# Altium project RCB_WiWi_STM32WL3.PrjPcb (part 2 of 2)

## Sheet 06-STM32WL3-RX.SchDoc
size B; SheetNumber: 6; SheetTotal: 8
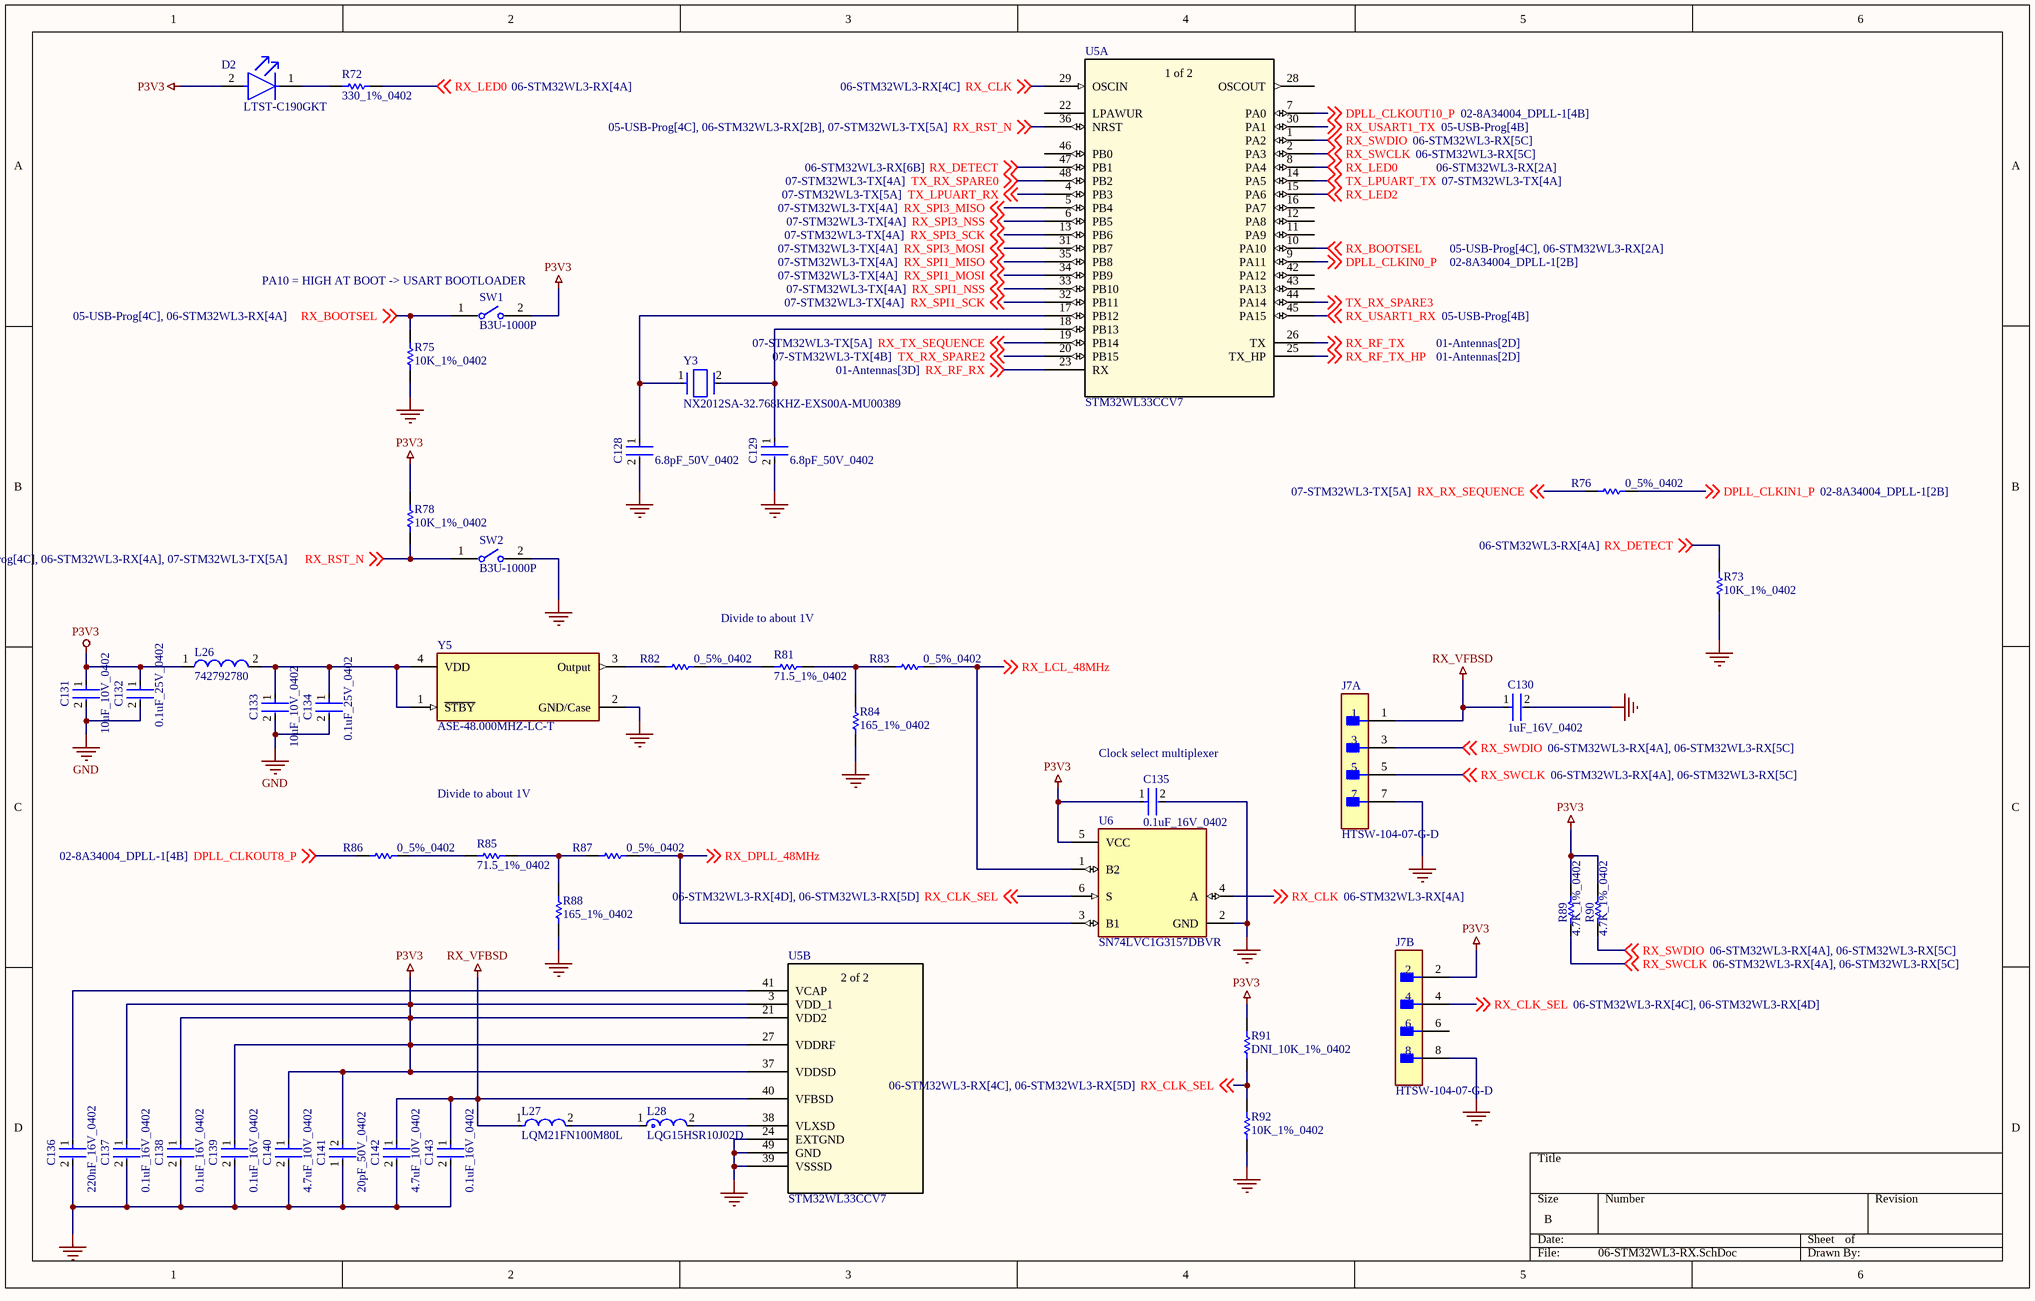
[diagram p3: 06-STM32WL3-RX.SchDoc]

### Parts
C128  6.8pF_50V_0402  [FP-GJM155-0_05-IPC_A]
C129  6.8pF_50V_0402  [FP-GJM155-0_05-IPC_A]
C130  1uF_16V_0402  [FP-0402-L_1_0_0_05-W_0_5-IPC_A]
C131  10uF_10V_0402  [FP-CL05A106MP5NUNC-MFG]
C132  0.1uF_25V_0402  [FP-0402-L_1_0_1-W_0_5_0_1-IPC_C]
C133  10uF_10V_0402  [FP-CL05A106MP5NUNC-MFG]
C134  0.1uF_25V_0402  [FP-0402-L_1_0_1-W_0_5_0_1-IPC_C]
C135  0.1uF_16V_0402  [FP-C0402-BB-MFG]
C136  220nF_16V_0402  [FP-GRM155-0_05-IPC_C]
C137  0.1uF_16V_0402  [FP-C0402-BB-MFG]
C138  0.1uF_16V_0402  [FP-C0402-BB-MFG]
C139  0.1uF_16V_0402  [FP-C0402-BB-MFG]
C140  4.7uF_10V_0402  [FP-C1005-050-0_15-MFG]
C141  20pF_50V_0402  [FP-CBR04C-MFG]
C142  4.7uF_10V_0402  [FP-C1005-050-0_15-MFG]
C143  0.1uF_16V_0402  [FP-C0402-BB-MFG]
D2  LTST-C190GKT  [FP-LTST-C190GKT-MFG]
J7  HTSW-104-07-G-D  [FP-HTSW-104-07-G-D-MFG]  (parts A,B of 2)
L26  742792780  [SMD-0402]
L27  LQM21FN100M80L  [FP-LQM21DH_70-IPC_C]
L28  LQG15HSR10J02D  [FP-LQG15HH_02-IPC_A]
R72  330_1%_0402  [RESC1005X40X25NL10T10]
R73  10K_1%_0402  [RESC1005X40X25NL10T10]
R75  10K_1%_0402  [RESC1005X40X25NL10T10]
R76  0_5%_0402  [RESC1005X40X25NL05T10]
R78  10K_1%_0402  [RESC1005X40X25NL10T10]
R81  71.5_1%_0402  [RESC1005X40X25NL05T05]
R82  0_5%_0402  [RESC1005X40X25NL05T10]
R83  0_5%_0402  [RESC1005X40X25NL05T10]
R84  165_1%_0402  [RESC1005X40X25NL05T05]
R85  71.5_1%_0402  [RESC1005X40X25NL05T05]
R86  0_5%_0402  [RESC1005X40X25NL05T10]
R87  0_5%_0402  [RESC1005X40X25NL05T10]
R88  165_1%_0402  [RESC1005X40X25NL05T05]
R89  4.7K_1%_0402  [RESC1005X40X25NL10T10]
R90  4.7K_1%_0402  [RESC1005X40X25NL10T10]
R91  DNI_10K_1%_0402  [RESC1005X40X25NL10T10]  (no BOM)
R92  10K_1%_0402  [RESC1005X40X25NL10T10]
SW1  B3U-1000P  [FP-B3U-1000P-MFG]
SW2  B3U-1000P  [FP-B3U-1000P-MFG]
U5  STM32WL33CCV7  [UFQFPN-48_STM]  (parts A,B of 2)
U6  SN74LVC1G3157DBVR  [FP-DBV0006A-IPC_C]
Y3  NX2012SA-32.768KHZ-EXS00A-MU00389  [FP-NX2012SA-MFG]
Y5  ASE-48.000MHZ-LC-T  [FP-ASE-MFG]

### Nets
GND: C128.2 C129.2 C130.2 C131.2 C132.2 C133.2 C134.2 C135.2 C136.2 C137.2 C138.2 C139.2 C140.2 C141.1 C142.2 C143.2 J7.7 J7.8 R73.2 R75.2 R84.1 R88.1 R92.2 SW2.2 U5.24(EXTGND) U5.39(VSSSD) U5.49(GND) U6.2(GND) Y5.2(GND/Case)
P3V3: C131.1 C132.1 C135.1 C137.1 C138.1 C139.1 C140.1 C141.2 D2.2(A) J7.2 L26.1 R78.1 R89.2 R90.2 R91.1 SW1.2 U5.3(VDD_1) U5.21(VDD2) U5.27(VDDRF) U5.37(VDDSD) U6.5(VCC)
RX_VFBSD: C130.1 C142.1 C143.1 J7.1 L27.1 U5.40(VFBSD)
DPLL_CLKIN0_P: U5.9(PA11) ; off-sheet DPLL_CLKIN0_P
DPLL_CLKIN1_P: R76.2 ; off-sheet DPLL_CLKIN1_P
DPLL_CLKOUT8_P: R86.1 ; off-sheet DPLL_CLKOUT8_P
DPLL_CLKOUT10_P: U5.7(PA0) ; off-sheet DPLL_CLKOUT10_P
RX_BOOTSEL: R75.1 SW1.1 U5.10(PA10) ; off-sheet RX_BOOTSEL
RX_CLK: U5.29(OSCIN) U6.4(A) ; off-sheet RX_CLK
RX_CLK_SEL: J7.4 R91.2 R92.1 U6.6(S) ; off-sheet RX_CLK_SEL
RX_DETECT: R73.1 U5.47(PB1) ; off-sheet RX_DETECT
RX_DPLL_48MHz: R87.2 U6.3(B1) ; off-sheet RX_DPLL_48MHz
RX_LCL_48MHz: R83.2 U6.1(B2) ; off-sheet RX_LCL_48MHz
RX_LED0: R72.1 U5.8(PA4) ; off-sheet RX_LED0
RX_LED2: U5.15(PA6) ; off-sheet RX_LED2
RX_RF_RX: U5.23(RX) ; off-sheet RX_RF_RX
RX_RF_TX: U5.26(TX) ; off-sheet RX_RF_TX
RX_RF_TX_HP: U5.25(TX_HP) ; off-sheet RX_RF_TX_HP
RX_RST_N: R78.2 SW2.1 U5.36(NRST) ; off-sheet RX_RST_N
RX_RX_SEQUENCE: R76.1 ; off-sheet RX_RX_SEQUENCE
RX_SPI1_MISO: U5.35(PB8) ; off-sheet RX_SPI1_MISO
RX_SPI1_MOSI: U5.34(PB9) ; off-sheet RX_SPI1_MOSI
RX_SPI1_NSS: U5.33(PB10) ; off-sheet RX_SPI1_NSS
RX_SPI1_SCK: U5.32(PB11) ; off-sheet RX_SPI1_SCK
RX_SPI3_MISO: U5.5(PB4) ; off-sheet RX_SPI3_MISO
RX_SPI3_MOSI: U5.31(PB7) ; off-sheet RX_SPI3_MOSI
RX_SPI3_NSS: U5.6(PB5) ; off-sheet RX_SPI3_NSS
RX_SPI3_SCK: U5.13(PB6) ; off-sheet RX_SPI3_SCK
RX_SWCLK: J7.5 R89.1 U5.2(PA3) ; off-sheet RX_SWCLK
RX_SWDIO: J7.3 R90.1 U5.1(PA2) ; off-sheet RX_SWDIO
RX_TX_SEQUENCE: U5.19(PB14) ; off-sheet RX_TX_SEQUENCE
RX_USART1_RX: U5.45(PA15) ; off-sheet RX_USART1_RX
RX_USART1_TX: U5.30(PA1) ; off-sheet RX_USART1_TX
TX_LPUART_RX: U5.4(PB3) ; off-sheet TX_LPUART_RX
TX_LPUART_TX: U5.14(PA5) ; off-sheet TX_LPUART_TX
TX_RX_SPARE0: U5.48(PB2) ; off-sheet TX_RX_SPARE0
TX_RX_SPARE2: U5.20(PB15) ; off-sheet TX_RX_SPARE2
TX_RX_SPARE3: U5.44(PA14) ; off-sheet TX_RX_SPARE3
NetC128_1: C128.1 U5.17(PB12) Y3.1
NetC129_1: C129.1 U5.18(PB13) Y3.2
NetC133_1: C133.1 C134.1 L26.2 Y5.1(~{STBY}) Y5.4(VDD)
NetC136_1: C136.1 U5.41(VCAP)
NetD2_1: D2.1(C) R72.2
NetL27_2: L27.2 L28.1
NetL28_2: L28.2 U5.38(VLXSD)
NetR81_1: R81.1 R82.2
NetR81_2: R81.2 R83.1 R84.2
NetR82_1: R82.1 Y5.3(Output)
NetR85_1: R85.1 R86.2
NetR85_2: R85.2 R87.1 R88.2

Not connected (* = marked no-connect by the designer): J7 6; U5 11(PA9) 12(PA8) 16(PA7) 22(LPAWUR) 28(OSCOUT) 42(PA12) 43(PA13) 46(PB0)

### Notes on the sheet
- (near SW1) PA10 = HIGH AT BOOT -> USART BOOTLOADER
- Divide to about 1V
- (near C135) Clock select multiplexer
- (in symbol STM32WL33CCV7, part A) 1 of 2
- (in symbol STM32WL33CCV7, part B) 2 of 2

### Library data of the parts
C128 C129 = CMP-2008-03875-2: Multi-Layer Ceramic Capacitor 6.8pF C0G  ±0.25pF 0402 Paper T/R; Voltage: 50V; Max Operating Temperature: 125°C; Height: 0.5mm; Capacitance: 6.8pF; Thickness: 0.022inch; Length: 1mm; Voltage Rating (DC): 50V; Packaging: Tape and Reel; Voltage Rating: 50V; Case Code (Imperial): 0402; Mount: Surface Mount; Package Quantity: 1; Lead Free: Lead Free; Width: 0.02inch; Radiation Hardening: No; Case Code (Metric): 1005; Depth: 0.5mm; Case/Package: 0402; Dielectric: C0G; Min Operating Temperature: -55°C; Termination: SMD/SMT
C130 = CMP-14477-000104-2: None; Tolerance: 10%; Voltage Rating: 16V; Dielectric: X5R; Capacitance: 1uF; Packaging: Tape and Reel; Depth: 0.5mm; Mount: Surface Mount; Thickness: 0.022inch; Package Quantity: 1; Min Operating Temperature: -55°C; Series: M; Voltage Rating (DC): 16V; Termination: SMD/SMT; Case/Package: 0402; Number of Pins: 2; Case Code (Imperial): 0402; Length: 1mm; Halogen Free: Halogen Free; Case Code (Metric): 1005; Width: 0.02inch; RoHS Compliant: Yes; Radiation Hardening: No; Max Operating Temperature: 85°C; Height: 0.5mm; Construction: Flat
C131 C133 = CMP-13271-000002-1: CAP CER 10UF 10V X5R 0402; Manufacturer Part Number: CL05A106MP5NUNC; Manufacturer: Samsung; Temperature Coefficient: 15%; Tolerance: 20%; Material: Ceramic; Octopart: https://octopart.com/cl05a106mp5nunc-samsung-22457395; Voltage Rating: 10V; RoHS: TRUE; Value: 10uF; Height: 0.7mm; Digikey Description: CAP CER 10UF 10V X5R 0402; Automotive: No; Package: CL05A106MP5NUNC; Device Class L1: Passive Components; Capacitance: 10uF; Temperature Range High: +85°C; ComponentLink2Description: Datasheet; Device Class L2: Capacitors; Temperature Characteristic: X5R; Temperature: -55°C to +85°C; ComponentLink2URL: http://www.samsungsem.com/kr/support/product-search/mlcc/__icsFiles/afieldfile/2019/05/10/19-CL05A106MP5NUNC.pdf; Device Class L3: Ceramic Capacitors; Category: Cap; Temperature Range Low: -55°C; Ipc Land Pattern Name: CAPC10050X50; Lead Free: Yes
C132 C134 = CMP-2008-02519-2: General Purpose Ceramic Capacitor, 0402, 100nF, 10%, X7R, 15%, 25V; Package Quantity: 1; Capacitance: 100nF; Min Operating Temperature: -55°C; Voltage: 25V; Voltage Rating: 25V; Construction: Flat; Max Operating Temperature: 125°C; Radiation Hardening: No; Depth: 0.5mm; Thickness: 0.022inch; Voltage Rating (DC): 25V; Number of Pins: 2; Lead Free: Lead Free; Series: -; REACH SVHC: No SVHC; Length: 1mm; Dielectric: X7R; RoHS Compliant: Yes; Mount: Surface Mount; Packaging: Tape and Reel; Case/Package: 0402; Case Code (Imperial): 0402; Termination: SMD/SMT; Width: 0.02inch; Case Code (Metric): 1005; Tolerance: 10%
C135 C137-C139 C143 = CMP-1034-02068-3: CAP CER 0.1UF 16V 5% X7R 0402; Manufacturer: Kemet; Manufacturer Part Number: C0402C104J4RACTU; Value: 0.10 μF; Temperature Coefficient: 15%; Tolerance: 0.05; Material: Ceramic; ComponentLink2URL: https://content.kemet.com/datasheets/KEM_C1002_X7R_SMD.pdf; Automotive: No; Device Class L2: Capacitors; Temperature: -55°C to +125°C; RoHS: TRUE; Voltage Rating: 16 V; ComponentLink2Description: Datasheet; Device Class L3: Ceramic Capacitors; Temperature Range Low: -55°C; Ipc Land Pattern Name: CAPC10050X50; Device Class L1: Passive Components; Temperature Range High: +125°C; Package: C0402-BB; Capacitance: 0.10 μF; Category: Cap; Mouser Description: CAP CER 0.1UF 16V X7R 0402; Height: 0.55mm; Digikey Description: CAP CER 0.1UF 16V 5% X7R 0402; Octopart: https://octopart.com/c0402c104j4ractu-kemet-12573893; Temperature Characteristic: X7R; Lead Free: Yes
C136 = CMP-1034-02089-3: Chip Multilayer Ceramic Capacitors for General Purpose, 0402, 0.22uF, X7R, 15%, 10%, 16V; Capacitance: 220nF; Depth: 0.5mm; Dielectric: X7R; Min Operating Temperature: -55°C; Package Quantity: 1; Termination: SMD/SMT; Mount: Surface Mount; Radiation Hardening: No; Height: 0.5mm; Case Code (Metric): 1005; Packaging: Tape and Reel; Material: Ceramic; Voltage: 16V; Voltage Rating (DC): 16V; REACH SVHC: No SVHC; Voltage Rating: 16V; Length: 1mm; Tolerance: 10%; Thickness: 0.022inch; Case Code (Imperial): 0402; Max Operating Temperature: 125°C; Width: 0.02inch; Lead Free: Lead Free; Case/Package: 0402
C140 C142 = CMP-2000-05997-2: CAP CER 4.7UF 10V X5R 0402; Dielectric Material: Ceramic; Tolerance: 10%; Series: C; Package Quantity: 10000; Max Operating Temperature: 85°C; Case Code (Imperial): 0402; Lead Free: Lead Free; Voltage Rating (DC): 10V; Packaging: Cut Tape; Voltage Rating: 10V; Min Operating Temperature: -55°C; Dielectric: X5R; Thickness: 0.022inch; Width: 0.02inch; Case/Package: 0402; Case Code (Metric): 1005; Capacitance: 4.7uF; Length: 0.039inch; RoHS Compliant: Yes; REACH SVHC: No SVHC; Mount: Surface Mount
C141 = CMP-2008-00009-2: CAP CER 20PF 50V C0G/NP0 0402; Manufacturer: KEMET; Manufacturer Part Number: CBR04C200J5GAC; Temperature Coefficient: 30ppm/°C; Material: Ceramic; Tolerance: 0.05; Temperature Characteristic: C0G; Automotive: No; Digikey Description: CAP CER 20PF 50V C0G/NP0 0402; Octopart: https://octopart.com/cbr04c200j5gac-kemet-20446742; Lead Free: Yes; Temperature: -55°C to +125°C; ComponentLink2Description: Datasheet; Height: 0.55mm; RoHS: TRUE; Voltage Rating: 50 V; Category: Cap; Value: 20 pF; Mouser Description: Cap Ceramic 20pF 50V C0G 5% SMD 0402 125°C Paper T/R; Package: CBR04C; Device Class L3: Ceramic Capacitors; Temperature Range High: +125°C; Capacitance: 20 pF; ComponentLink2URL: https://content.kemet.com/datasheets/KEM_C1030_CBR_SMD.pdf; Device Class L2: Capacitors; Temperature Range Low: -55°C; Device Class L1: Passive Components; Ipc Land Pattern Name: CAPC10050X50
D2 = CMP-22017-000005-2: LED GREEN CLEAR CHIP SMD; Dominant Wavelength: 569nm; Reverse Voltage: 5V; Lens Color: Colorless; Viewing Angle: 130°; Voltage: 2V; Forward Current: 30mA; Power Dissipation: 100mW; Luminous Intensity: 6mcd; Number of LEDs: 1; Forward Voltage: 2.1V; Wavelength: 565nm; Test Current: 10mA; Min Operating Temperature: -55°C; Lens Style: Clear; Mount: Surface Mount; Width: 0.8mm; Packaging: Tape and Reel; Lens Transparency: Clear; Case Code (Metric): 1608; Depth: 0.8mm; Case Code (Imperial): 0603; Case/Package: 0603; Number of Pins: 2; Max Operating Temperature: 85°C; Lead Free: Lead Free; Number of Elements: 1; Length: 1.6mm; Height: 0.8mm; Package Quantity: 1; Power Rating: 100mW; Radiation Hardening: No; Illumination Color: Green; Color: Green
J7 = CMP-02766-000066-1: CONN HEADER VERT 8POS 2.54MM; Manufacturer: Samtec; Conn Orientation: Straight; Voltage Rating: 550V; Current Rating: 6.3A; Number Of Contacts: 8; Conn Gender: Male; Lead Free: Yes; ComponentLink2URL: http://suddendocs.samtec.com/prints/htsw-xxx-xx-xxx-x-xx-xx-xx-mkt.pdf; Category: Conn; Octopart: https://octopart.com/htsw-104-07-g-d-samtec-10613822; RoHS: TRUE; Device Class L2: Headers and Wire Housings; Device Class L3: unset; ComponentLink2Description: Datasheet; Number Of Rows: 2; Digikey Description: CONN HEADER VERT 8POS 2.54MM; Temperature Range Low: -55°C; Temperature: -55°C to +125°C; Automotive: No; Temperature Range High: +125°C; Footprint Url: http://suddendocs.samtec.com/prints/htsw-xxx-xx-xxx-x-xx-xx-xx-footprint.pdf; Device Class L1: Connectors; Pitch: 2.54mm; Manufacturer Part Number: HTSW-104-07-G-D; Package: HTSW-104-07-G-D; Contact Material: Gold,Nickel; Height: 8.71mm
L26 = CMP-0220-00137-1: SMD EMI Suppression Ferrite Bead WE-CBF, Z = 220 Ohm; Impedance: 220 Ohm; PackageVersion: 2009; DatasheetVersion: ver 4, Jul-2009; PackageDescription: Chip Inductor, 2-Leads, Body 1.0 x 0.5 mm; ComponentLink1URL: http://www.we-online.com; ComponentLink1Description: Manufacturer Link; ComponentLink2URL: http://www.we-online.de/katalog/media/pdf/742792780.pdf; PackageReference: SMD-0402; ComponentLink2Description: Datasheet
L27 = CMP-06042-014493-1: Multilayer Type Inductor for Power Lines, 0805 (2012), 10μH, 20%, 0.39Ω, 100mA; Self Resonant Frequency: 15MHz; Test Frequency: 1MHz; DC Resistance (DCR): 300mR; Shielding: Shielded; Core Material: Ferrite; Inductance: 10uH; Depth: 1.45mm; Length: 2mm; Mount: Surface Mount; Case Code (Imperial): 0805; Max Operating Temperature: 125°C; Tolerance: 20%; Case Code (Metric): 2012; Lead Free: Lead Free; Case/Package: 0805; Radiation Hardening: No; Termination: SMD/SMT; Min Operating Temperature: -40°C; Packaging: Tape and Reel; Height: 1.25mm; DC Current: 100mA; Package Quantity: 3000; Inductance Tolerance: 20%; Current Rating: 100mA; Max DC Current: 100mA; Military Standard: Not; Width: 1.25mm; REACH SVHC: No SVHC
L28 = CMP-06042-015241-1: Multilayer type RF Inductor 100nH ±5% 1.25Ω 200mA 0402; Q Factor: 8; Shielding: Unshielded; Max DC Current: 150mA; Core Material: Air; Self Resonant Frequency: 600MHz; DC Resistance (DCR): 1.25R; Test Frequency: 100MHz; Tolerance: 5%; Package Quantity: 10000; Case Code (Imperial): 0402; Case Code (Metric): 1005; Max Operating Temperature: 125°C; Current Rating: 150mA; Min Operating Temperature: -55°C; Height: 0.5mm; DC Current: 150mA; Length: 1mm; Radiation Hardening: No; Termination: SMD/SMT; Case/Package: 0402; Height - Seated (Max): 0.022inch; Lead Free: Lead Free; Width: 0.02inch; Packaging: Tape and Reel; Inductance: 100nH; Military Standard: Not; Mount: Surface Mount; Depth: 0.55mm
R72 = CMP-2002-05853-1: Manufacturer: Panasonic; Part Number: ERA-2AED331X
R73 R75 R78 R91 R92 = CMP-2002-04694-1: Manufacturer: Bourns; Part Number: CR0402-FX-1002GLF
R76 R82 R83 R86 R87 = CMP-2002-06457-1: Manufacturer: Panasonic; Part Number: ERJ-U020R00X
R81 R85 = CMP-2002-00202-1: Manufacturer: Vishay Dale; Part Number: CRCW040271R5FKED
R84 R88 = CMP-2002-08233-1: Manufacturer: Vishay Dale; Part Number: CRCW0402165RFKED
R89 R90 = CMP-2002-05217-1: Manufacturer: Bourns; Part Number: CR0402-FX-4701GLF
SW1 SW2 = CMP-2100-03586-2: SWITCH TACTILE SPST-NO 0.05A 12V; Contact Resistance: 100mR; Operating Force: 1.5N; Max Current Rating: 50mA; Switch Travel: 0.15mm; Actuator Type: Standard; Mechanical Life: 200000Cycles; Ratings: Dust Proof; Illumination Type: Non-Illuminated; Throw Configuration: SPST; Actuator Length: 0.4mm; Switch Function: Off-Mom; Height: 1.2mm; Width: 3mm; Weight: 0.000776oz; Contact Material: Silver; Max Voltage Rating (DC): 12V; Insulation Resistance: 100MR; Lead Free: Lead Free; Current Rating: 50mA; Termination: SMD/SMT; Length: 4mm; Voltage Rating (DC): 12V; Contact Current Rating: 50mA; Orientation: Straight; Depth: 2.5mm; Max Operating Temperature: 70°C; Packaging: Tape and Reel; Min Operating Temperature: -25°C; Package Quantity: 1; Mount: Surface Mount; Electrical Life: 200000Cycles
U5 = STM32WL33CCV7: No Description Available; Mfr_Name: STMicroelectronics; RefDes: RefDes; Type: Type
U6 = CMP-0859-00203-4: IC SWITCH SPDT SOT23-6; Number of Outputs: 2; Propagation Delay: 300ps; On-State Resistance: 15R; Nominal Supply Current: 10uA; Number of Inputs: 1; Max Supply Voltage: 5.5V; Supply Type: Single; Low Level Output Current: 128mA; Bandwidth: 300MHz; Turn-Off Delay Time: 3.8ns; Turn-On Delay Time: 5.7ns; Operating Supply Current: 1uA; Min Supply Voltage: 1.65V; Polarity: Non-Inverting; Height: 1.3mm; Number of Bits: 1; Case/Package: SOT-23; REACH SVHC: No SVHC; High Level Output Current: 128mA; Weight: 0.000229oz; Max Supply Current: 10uA; Width: 1.75mm; Radiation Hardening: No; Supply Current: 10uA; Length: 3.05mm; Max Operating Temperature: 125°C; Min Operating Temperature: -40°C; Package Quantity: 3000; Number of Pins: 6; Termination: SMD/SMT; Series: 74LVC; Packaging: Tape and Reel; Lead Free: Lead Free; Contact Plating: Gold; Mount: Surface Mount; RoHS Compliant: Yes; Number of Channels: 1; Throw Configuration: SPDT
Y3 = CMP-200220-000005-1: CRYSTAL 32.768KHZ 7PF SMD; Manufacturer: NDK America; Esr: 80kΩ; Load Capacitance: 12.5pF; Tolerance: 20ppm; Digikey Description: CRYSTAL 32.768KHZ 7PF SMD; Frequency: 32.768kHz; Automotive: No; Series: NX2012SA; Package: NX2012SA; Height: 0.6mm; ComponentLink2Description: Datasheet; Device Class L1: Passive Components; Device Class L3: Crystals; Temperature: -40°C to +85°C; Temperature Range Low: -40°C; RoHS: TRUE; Manufacturer Part Number: NX2012SA-32.768KHZ-EXS00A-MU00389; Lead Free: Yes; Device Class L2: Crystals / Oscillators; Category: Crys; ComponentLink2URL: https://www.ndk.com/images/products/catalog/c_NX2012SA-STD-MUB-1_e.pdf; Temperature Range High: +85°C; Octopart: https://octopart.com/nx2012sa-32.768khz-exs00a-mu00389-ndk-92010294
Y5 = CMP-27762-000273-1: XTAL Oscillator 48MHz ±50ppm CMOS 3.3V 4-SMD 3.2mm x 2.5mm; Min Supply Voltage: 3.135V; Max Supply Voltage: 3.465V; Load Capacitance: 15pF; Max Supply Current: 19mA; Series: ASE; Radiation Hardening: No; Lead Free: Lead Free; Package Quantity: 1000; Frequency: 48MHz; Frequency Stability: 50ppm; Case/Package: SMD/SMT; REACH SVHC: No SVHC; Operating Frequency: 48 MHz; Mount: Surface Mount; Min Operating Temperature: -40°C; Packaging: Tape and Reel; Max Operating Temperature: 85°C; Depth: 2.5mm; Height: 0.047inch; Width: 0.098inch; Length: 3.2mm; Termination: SMD/SMT; Number of Pins: 4; Operating Supply Voltage: 3.3V

## Sheet 07-STM32WL3-TX.SchDoc
size B; SheetNumber: 7; SheetTotal: 8
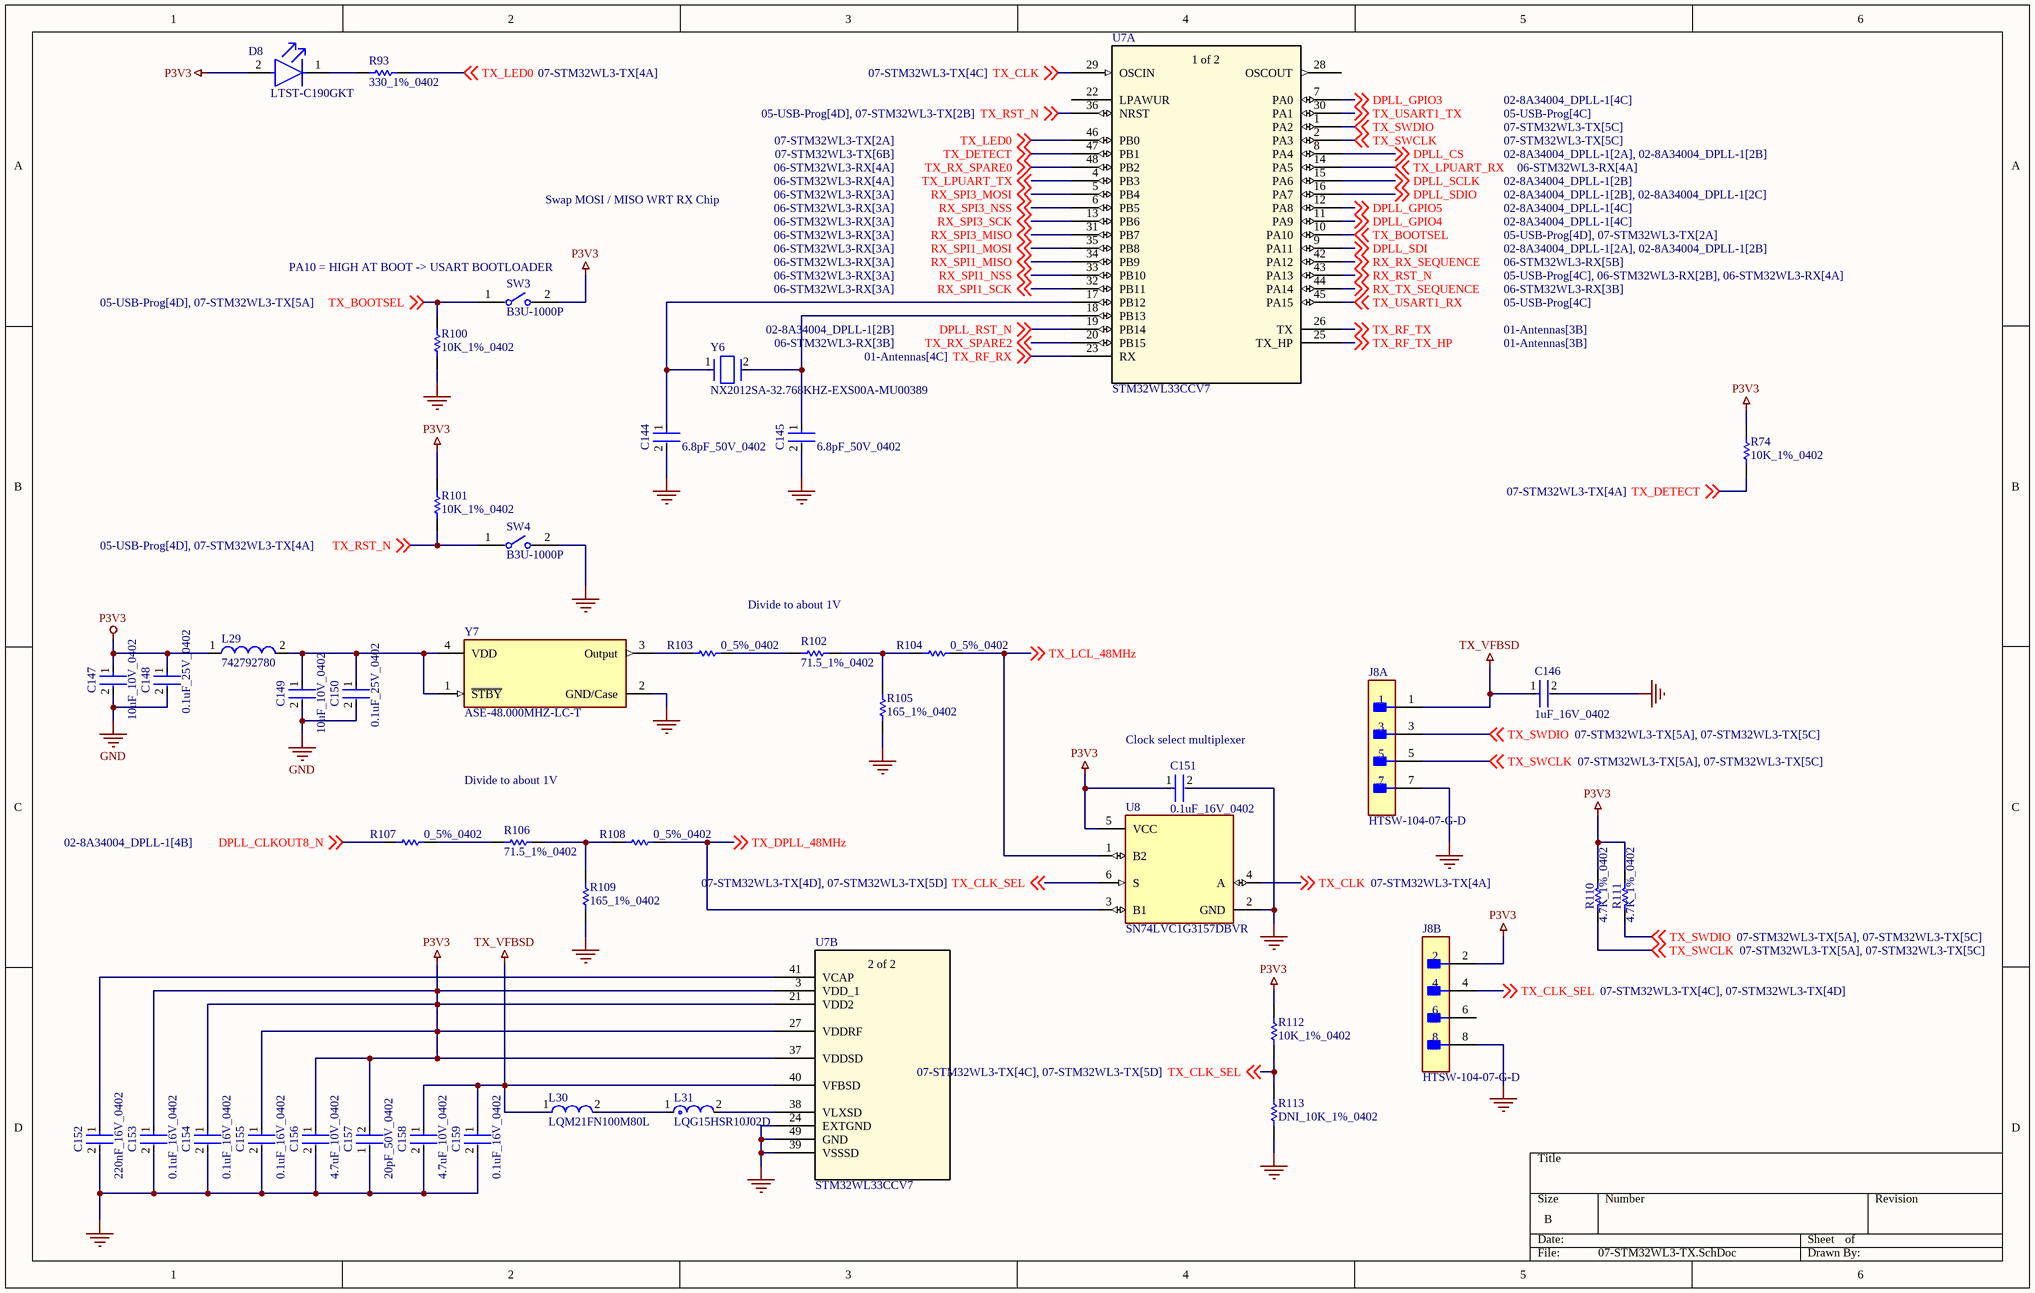
[diagram p4: 07-STM32WL3-TX.SchDoc]

### Parts
C144  6.8pF_50V_0402  [FP-GJM155-0_05-IPC_A]
C145  6.8pF_50V_0402  [FP-GJM155-0_05-IPC_A]
C146  1uF_16V_0402  [FP-0402-L_1_0_0_05-W_0_5-IPC_A]
C147  10uF_10V_0402  [FP-CL05A106MP5NUNC-MFG]
C148  0.1uF_25V_0402  [FP-0402-L_1_0_1-W_0_5_0_1-IPC_C]
C149  10uF_10V_0402  [FP-CL05A106MP5NUNC-MFG]
C150  0.1uF_25V_0402  [FP-0402-L_1_0_1-W_0_5_0_1-IPC_C]
C151  0.1uF_16V_0402  [FP-C0402-BB-MFG]
C152  220nF_16V_0402  [FP-GRM155-0_05-IPC_C]
C153  0.1uF_16V_0402  [FP-C0402-BB-MFG]
C154  0.1uF_16V_0402  [FP-C0402-BB-MFG]
C155  0.1uF_16V_0402  [FP-C0402-BB-MFG]
C156  4.7uF_10V_0402  [FP-C1005-050-0_15-MFG]
C157  20pF_50V_0402  [FP-CBR04C-MFG]
C158  4.7uF_10V_0402  [FP-C1005-050-0_15-MFG]
C159  0.1uF_16V_0402  [FP-C0402-BB-MFG]
D8  LTST-C190GKT  [FP-LTST-C190GKT-MFG]
J8  HTSW-104-07-G-D  [FP-HTSW-104-07-G-D-MFG]  (parts A,B of 2)
L29  742792780  [SMD-0402]
L30  LQM21FN100M80L  [FP-LQM21DH_70-IPC_C]
L31  LQG15HSR10J02D  [FP-LQG15HH_02-IPC_A]
R74  10K_1%_0402  [RESC1005X40X25NL10T10]
R93  330_1%_0402  [RESC1005X40X25NL10T10]
R100  10K_1%_0402  [RESC1005X40X25NL10T10]
R101  10K_1%_0402  [RESC1005X40X25NL10T10]
R102  71.5_1%_0402  [RESC1005X40X25NL05T05]
R103  0_5%_0402  [RESC1005X40X25NL05T10]
R104  0_5%_0402  [RESC1005X40X25NL05T10]
R105  165_1%_0402  [RESC1005X40X25NL05T05]
R106  71.5_1%_0402  [RESC1005X40X25NL05T05]
R107  0_5%_0402  [RESC1005X40X25NL05T10]
R108  0_5%_0402  [RESC1005X40X25NL05T10]
R109  165_1%_0402  [RESC1005X40X25NL05T05]
R110  4.7K_1%_0402  [RESC1005X40X25NL10T10]
R111  4.7K_1%_0402  [RESC1005X40X25NL10T10]
R112  10K_1%_0402  [RESC1005X40X25NL10T10]
R113  DNI_10K_1%_0402  [RESC1005X40X25NL10T10]  (no BOM)
SW3  B3U-1000P  [FP-B3U-1000P-MFG]
SW4  B3U-1000P  [FP-B3U-1000P-MFG]
U7  STM32WL33CCV7  [UFQFPN-48_STM]  (parts A,B of 2)
U8  SN74LVC1G3157DBVR  [FP-DBV0006A-IPC_C]
Y6  NX2012SA-32.768KHZ-EXS00A-MU00389  [FP-NX2012SA-MFG]
Y7  ASE-48.000MHZ-LC-T  [FP-ASE-MFG]

### Nets
GND: C144.2 C145.2 C146.2 C147.2 C148.2 C149.2 C150.2 C151.2 C152.2 C153.2 C154.2 C155.2 C156.2 C157.1 C158.2 C159.2 J8.7 J8.8 R100.2 R105.1 R109.1 R113.2 SW4.2 U7.24(EXTGND) U7.39(VSSSD) U7.49(GND) U8.2(GND) Y7.2(GND/Case)
P3V3: C147.1 C148.1 C151.1 C153.1 C154.1 C155.1 C156.1 C157.2 D8.2(A) J8.2 L29.1 R74.1 R101.1 R110.2 R111.2 R112.1 SW3.2 U7.3(VDD_1) U7.21(VDD2) U7.27(VDDRF) U7.37(VDDSD) U8.5(VCC)
TX_VFBSD: C146.1 C158.1 C159.1 J8.1 L30.1 U7.40(VFBSD)
DPLL_CLKOUT8_N: R107.1 ; off-sheet DPLL_CLKOUT8_N
DPLL_CS: U7.8(PA4) ; off-sheet DPLL_CS
DPLL_GPIO3: U7.7(PA0) ; off-sheet DPLL_GPIO3
DPLL_GPIO4: U7.11(PA9) ; off-sheet DPLL_GPIO4
DPLL_GPIO5: U7.12(PA8) ; off-sheet DPLL_GPIO5
DPLL_RST_N: U7.19(PB14) ; off-sheet DPLL_RST_N
DPLL_SCLK: U7.15(PA6) ; off-sheet DPLL_SCLK
DPLL_SDI: U7.9(PA11) ; off-sheet DPLL_SDI
DPLL_SDIO: U7.16(PA7) ; off-sheet DPLL_SDIO
RX_RST_N: U7.43(PA13) ; off-sheet RX_RST_N
RX_RX_SEQUENCE: U7.42(PA12) ; off-sheet RX_RX_SEQUENCE
RX_SPI1_MISO: U7.34(PB9) ; off-sheet RX_SPI1_MISO
RX_SPI1_MOSI: U7.35(PB8) ; off-sheet RX_SPI1_MOSI
RX_SPI1_NSS: U7.33(PB10) ; off-sheet RX_SPI1_NSS
RX_SPI1_SCK: U7.32(PB11) ; off-sheet RX_SPI1_SCK
RX_SPI3_MISO: U7.31(PB7) ; off-sheet RX_SPI3_MISO
RX_SPI3_MOSI: U7.5(PB4) ; off-sheet RX_SPI3_MOSI
RX_SPI3_NSS: U7.6(PB5) ; off-sheet RX_SPI3_NSS
RX_SPI3_SCK: U7.13(PB6) ; off-sheet RX_SPI3_SCK
RX_TX_SEQUENCE: U7.44(PA14) ; off-sheet RX_TX_SEQUENCE
TX_BOOTSEL: R100.1 SW3.1 U7.10(PA10) ; off-sheet TX_BOOTSEL
TX_CLK: U7.29(OSCIN) U8.4(A) ; off-sheet TX_CLK
TX_CLK_SEL: J8.4 R112.2 R113.1 U8.6(S) ; off-sheet TX_CLK_SEL
TX_DETECT: R74.2 U7.47(PB1) ; off-sheet TX_DETECT
TX_DPLL_48MHz: R108.2 U8.3(B1) ; off-sheet TX_DPLL_48MHz
TX_LCL_48MHz: R104.2 U8.1(B2) ; off-sheet TX_LCL_48MHz
TX_LED0: R93.1 U7.46(PB0) ; off-sheet TX_LED0
TX_LPUART_RX: U7.14(PA5) ; off-sheet TX_LPUART_RX
TX_LPUART_TX: U7.4(PB3) ; off-sheet TX_LPUART_TX
TX_RF_RX: U7.23(RX) ; off-sheet TX_RF_RX
TX_RF_TX: U7.26(TX) ; off-sheet TX_RF_TX
TX_RF_TX_HP: U7.25(TX_HP) ; off-sheet TX_RF_TX_HP
TX_RST_N: R101.2 SW4.1 U7.36(NRST) ; off-sheet TX_RST_N
TX_RX_SPARE0: U7.48(PB2) ; off-sheet TX_RX_SPARE0
TX_RX_SPARE2: U7.20(PB15) ; off-sheet TX_RX_SPARE2
TX_SWCLK: J8.5 R110.1 U7.2(PA3) ; off-sheet TX_SWCLK
TX_SWDIO: J8.3 R111.1 U7.1(PA2) ; off-sheet TX_SWDIO
TX_USART1_RX: U7.45(PA15) ; off-sheet TX_USART1_RX
TX_USART1_TX: U7.30(PA1) ; off-sheet TX_USART1_TX
NetC144_1: C144.1 U7.17(PB12) Y6.1
NetC145_1: C145.1 U7.18(PB13) Y6.2
NetC149_1: C149.1 C150.1 L29.2 Y7.1(~{STBY}) Y7.4(VDD)
NetC152_1: C152.1 U7.41(VCAP)
NetD8_1: D8.1(C) R93.2
NetL30_2: L30.2 L31.1
NetL31_2: L31.2 U7.38(VLXSD)
NetR102_1: R102.1 R103.2
NetR102_2: R102.2 R104.1 R105.2
NetR103_1: R103.1 Y7.3(Output)
NetR106_1: R106.1 R107.2
NetR106_2: R106.2 R108.1 R109.2

Not connected (* = marked no-connect by the designer): J8 6; U7 22(LPAWUR) 28(OSCOUT)

### Notes on the sheet
- Swap MOSI / MISO WRT RX Chip
- (near SW3) PA10 = HIGH AT BOOT -> USART BOOTLOADER
- Divide to about 1V
- (near C151) Clock select multiplexer
- (in symbol STM32WL33CCV7, part A) 1 of 2
- (in symbol STM32WL33CCV7, part B) 2 of 2

### Library data of the parts
C144 C145 = CMP-2008-03875-2: as C128 on sheet 06-STM32WL3-RX; Max Operating Temperature: 125°C; Height: 0.5mm; Capacitance: 6.8pF; Thickness: 0.022inch; Length: 1mm; Voltage Rating (DC): 50V; Packaging: Tape and Reel; Voltage Rating: 50V; Case Code (Imperial): 0402; Mount: Surface Mount; Package Quantity: 1; Lead Free: Lead Free; Width: 0.02inch; Radiation Hardening: No; Case Code (Metric): 1005; Depth: 0.5mm; Case/Package: 0402; Dielectric: C0G; Min Operating Temperature: -55°C; Termination: SMD/SMT
C146 = CMP-14477-000104-2: as C130 on sheet 06-STM32WL3-RX; Packaging: Tape and Reel; Depth: 0.5mm; Mount: Surface Mount; Thickness: 0.022inch; Package Quantity: 1; Min Operating Temperature: -55°C; Series: M; Voltage Rating (DC): 16V; Termination: SMD/SMT; Case/Package: 0402; Number of Pins: 2; Case Code (Imperial): 0402; Length: 1mm; Halogen Free: Halogen Free; Case Code (Metric): 1005; Width: 0.02inch; RoHS Compliant: Yes; Radiation Hardening: No; Max Operating Temperature: 85°C; Height: 0.5mm; Construction: Flat
C147 C149 = CMP-13271-000002-1: as C131 on sheet 06-STM32WL3-RX; Octopart: https://octopart.com/cl05a106mp5nunc-samsung-22457395; Voltage Rating: 10V; RoHS: TRUE; Value: 10uF; Height: 0.7mm; Digikey Description: CAP CER 10UF 10V X5R 0402; Automotive: No; Package: CL05A106MP5NUNC; Device Class L1: Passive Components; Capacitance: 10uF; Temperature Range High: +85°C; ComponentLink2Description: Datasheet; Device Class L2: Capacitors; Temperature Characteristic: X5R; Temperature: -55°C to +85°C; ComponentLink2URL: http://www.samsungsem.com/kr/support/product-search/mlcc/__icsFiles/afieldfile/2019/05/10/19-CL05A106MP5NUNC.pdf; Device Class L3: Ceramic Capacitors; Category: Cap; Temperature Range Low: -55°C; Ipc Land Pattern Name: CAPC10050X50; Lead Free: Yes
C148 C150 = CMP-2008-02519-2: as C132 on sheet 06-STM32WL3-RX; Package Quantity: 1; Capacitance: 100nF; Min Operating Temperature: -55°C; Voltage: 25V; Voltage Rating: 25V; Construction: Flat; Max Operating Temperature: 125°C; Radiation Hardening: No; Depth: 0.5mm; Thickness: 0.022inch; Voltage Rating (DC): 25V; Number of Pins: 2; Lead Free: Lead Free; Series: -; REACH SVHC: No SVHC; Length: 1mm; Dielectric: X7R; RoHS Compliant: Yes; Mount: Surface Mount; Packaging: Tape and Reel; Case/Package: 0402; Case Code (Imperial): 0402; Termination: SMD/SMT; Width: 0.02inch; Case Code (Metric): 1005; Tolerance: 10%
C151 C153-C155 C159 = CMP-1034-02068-3: as C135 on sheet 06-STM32WL3-RX; ComponentLink2URL: https://content.kemet.com/datasheets/KEM_C1002_X7R_SMD.pdf; Automotive: No; Device Class L2: Capacitors; Temperature: -55°C to +125°C; RoHS: TRUE; Voltage Rating: 16 V; ComponentLink2Description: Datasheet; Device Class L3: Ceramic Capacitors; Temperature Range Low: -55°C; Ipc Land Pattern Name: CAPC10050X50; Device Class L1: Passive Components; Temperature Range High: +125°C; Package: C0402-BB; Capacitance: 0.10 μF; Category: Cap; Mouser Description: CAP CER 0.1UF 16V X7R 0402; Height: 0.55mm; Digikey Description: CAP CER 0.1UF 16V 5% X7R 0402; Octopart: https://octopart.com/c0402c104j4ractu-kemet-12573893; Temperature Characteristic: X7R; Lead Free: Yes
C152 = CMP-1034-02089-3: as C136 on sheet 06-STM32WL3-RX; Depth: 0.5mm; Dielectric: X7R; Min Operating Temperature: -55°C; Package Quantity: 1; Termination: SMD/SMT; Mount: Surface Mount; Radiation Hardening: No; Height: 0.5mm; Case Code (Metric): 1005; Packaging: Tape and Reel; Material: Ceramic; Voltage: 16V; Voltage Rating (DC): 16V; REACH SVHC: No SVHC; Voltage Rating: 16V; Length: 1mm; Tolerance: 10%; Thickness: 0.022inch; Case Code (Imperial): 0402; Max Operating Temperature: 125°C; Width: 0.02inch; Lead Free: Lead Free; Case/Package: 0402
C156 C158 = CMP-2000-05997-2: as C140 on sheet 06-STM32WL3-RX; Series: C; Package Quantity: 10000; Max Operating Temperature: 85°C; Case Code (Imperial): 0402; Lead Free: Lead Free; Voltage Rating (DC): 10V; Packaging: Cut Tape; Voltage Rating: 10V; Min Operating Temperature: -55°C; Dielectric: X5R; Thickness: 0.022inch; Width: 0.02inch; Case/Package: 0402; Case Code (Metric): 1005; Capacitance: 4.7uF; Length: 0.039inch; RoHS Compliant: Yes; REACH SVHC: No SVHC; Mount: Surface Mount
C157 = CMP-2008-00009-2: as C141 on sheet 06-STM32WL3-RX; Automotive: No; Digikey Description: CAP CER 20PF 50V C0G/NP0 0402; Octopart: https://octopart.com/cbr04c200j5gac-kemet-20446742; Lead Free: Yes; Temperature: -55°C to +125°C; ComponentLink2Description: Datasheet; Height: 0.55mm; RoHS: TRUE; Voltage Rating: 50 V; Category: Cap; Value: 20 pF; Mouser Description: Cap Ceramic 20pF 50V C0G 5% SMD 0402 125°C Paper T/R; Package: CBR04C; Device Class L3: Ceramic Capacitors; Temperature Range High: +125°C; Capacitance: 20 pF; ComponentLink2URL: https://content.kemet.com/datasheets/KEM_C1030_CBR_SMD.pdf; Device Class L2: Capacitors; Temperature Range Low: -55°C; Device Class L1: Passive Components; Ipc Land Pattern Name: CAPC10050X50
D8 = CMP-22017-000005-2: as D2 on sheet 06-STM32WL3-RX; Min Operating Temperature: -55°C; Lens Style: Clear; Mount: Surface Mount; Width: 0.8mm; Packaging: Tape and Reel; Lens Transparency: Clear; Case Code (Metric): 1608; Depth: 0.8mm; Case Code (Imperial): 0603; Case/Package: 0603; Number of Pins: 2; Max Operating Temperature: 85°C; Lead Free: Lead Free; Number of Elements: 1; Length: 1.6mm; Height: 0.8mm; Package Quantity: 1; Power Rating: 100mW; Radiation Hardening: No; Illumination Color: Green; Color: Green
J8 = CMP-02766-000066-1: as J7 on sheet 06-STM32WL3-RX; Lead Free: Yes; ComponentLink2URL: http://suddendocs.samtec.com/prints/htsw-xxx-xx-xxx-x-xx-xx-xx-mkt.pdf; Category: Conn; Octopart: https://octopart.com/htsw-104-07-g-d-samtec-10613822; RoHS: TRUE; Device Class L2: Headers and Wire Housings; Device Class L3: unset; ComponentLink2Description: Datasheet; Number Of Rows: 2; Digikey Description: CONN HEADER VERT 8POS 2.54MM; Temperature Range Low: -55°C; Temperature: -55°C to +125°C; Automotive: No; Temperature Range High: +125°C; Footprint Url: http://suddendocs.samtec.com/prints/htsw-xxx-xx-xxx-x-xx-xx-xx-footprint.pdf; Device Class L1: Connectors; Pitch: 2.54mm; Manufacturer Part Number: HTSW-104-07-G-D; Package: HTSW-104-07-G-D; Contact Material: Gold,Nickel; Height: 8.71mm
L29 = CMP-0220-00137-1: as L26 on sheet 06-STM32WL3-RX; PackageVersion: 2009; DatasheetVersion: ver 4, Jul-2009; PackageDescription: Chip Inductor, 2-Leads, Body 1.0 x 0.5 mm; ComponentLink1URL: http://www.we-online.com; ComponentLink1Description: Manufacturer Link; ComponentLink2URL: http://www.we-online.de/katalog/media/pdf/742792780.pdf; PackageReference: SMD-0402; ComponentLink2Description: Datasheet
L30 = CMP-06042-014493-1: as L27 on sheet 06-STM32WL3-RX; Depth: 1.45mm; Length: 2mm; Mount: Surface Mount; Case Code (Imperial): 0805; Max Operating Temperature: 125°C; Tolerance: 20%; Case Code (Metric): 2012; Lead Free: Lead Free; Case/Package: 0805; Radiation Hardening: No; Termination: SMD/SMT; Min Operating Temperature: -40°C; Packaging: Tape and Reel; Height: 1.25mm; DC Current: 100mA; Package Quantity: 3000; Inductance Tolerance: 20%; Current Rating: 100mA; Max DC Current: 100mA; Military Standard: Not; Width: 1.25mm; REACH SVHC: No SVHC
L31 = CMP-06042-015241-1: as L28 on sheet 06-STM32WL3-RX; Tolerance: 5%; Package Quantity: 10000; Case Code (Imperial): 0402; Case Code (Metric): 1005; Max Operating Temperature: 125°C; Current Rating: 150mA; Min Operating Temperature: -55°C; Height: 0.5mm; DC Current: 150mA; Length: 1mm; Radiation Hardening: No; Termination: SMD/SMT; Case/Package: 0402; Height - Seated (Max): 0.022inch; Lead Free: Lead Free; Width: 0.02inch; Packaging: Tape and Reel; Inductance: 100nH; Military Standard: Not; Mount: Surface Mount; Depth: 0.55mm
R74 R100 R101 R112 R113 = CMP-2002-04694-1: as R73 on sheet 06-STM32WL3-RX
R93 = CMP-2002-05853-1: as R72 on sheet 06-STM32WL3-RX
R102 R106 = CMP-2002-00202-1: as R81 on sheet 06-STM32WL3-RX
R103 R104 R107 R108 = CMP-2002-06457-1: as R76 on sheet 06-STM32WL3-RX
R105 R109 = CMP-2002-08233-1: as R84 on sheet 06-STM32WL3-RX
R110 R111 = CMP-2002-05217-1: as R89 on sheet 06-STM32WL3-RX
SW3 SW4 = CMP-2100-03586-2: as SW1 on sheet 06-STM32WL3-RX; Height: 1.2mm; Width: 3mm; Weight: 0.000776oz; Contact Material: Silver; Max Voltage Rating (DC): 12V; Insulation Resistance: 100MR; Lead Free: Lead Free; Current Rating: 50mA; Termination: SMD/SMT; Length: 4mm; Voltage Rating (DC): 12V; Contact Current Rating: 50mA; Orientation: Straight; Depth: 2.5mm; Max Operating Temperature: 70°C; Packaging: Tape and Reel; Min Operating Temperature: -25°C; Package Quantity: 1; Mount: Surface Mount; Electrical Life: 200000Cycles
U7 = STM32WL33CCV7: as U5 on sheet 06-STM32WL3-RX; RefDes: RefDes; Type: Type
U8 = CMP-0859-00203-4: as U6 on sheet 06-STM32WL3-RX; Height: 1.3mm; Number of Bits: 1; Case/Package: SOT-23; REACH SVHC: No SVHC; High Level Output Current: 128mA; Weight: 0.000229oz; Max Supply Current: 10uA; Width: 1.75mm; Radiation Hardening: No; Supply Current: 10uA; Length: 3.05mm; Max Operating Temperature: 125°C; Min Operating Temperature: -40°C; Package Quantity: 3000; Number of Pins: 6; Termination: SMD/SMT; Series: 74LVC; Packaging: Tape and Reel; Lead Free: Lead Free; Contact Plating: Gold; Mount: Surface Mount; RoHS Compliant: Yes; Number of Channels: 1; Throw Configuration: SPDT
Y6 = CMP-200220-000005-1: as Y3 on sheet 06-STM32WL3-RX; Digikey Description: CRYSTAL 32.768KHZ 7PF SMD; Frequency: 32.768kHz; Automotive: No; Series: NX2012SA; Package: NX2012SA; Height: 0.6mm; ComponentLink2Description: Datasheet; Device Class L1: Passive Components; Device Class L3: Crystals; Temperature: -40°C to +85°C; Temperature Range Low: -40°C; RoHS: TRUE; Manufacturer Part Number: NX2012SA-32.768KHZ-EXS00A-MU00389; Lead Free: Yes; Device Class L2: Crystals / Oscillators; Category: Crys; ComponentLink2URL: https://www.ndk.com/images/products/catalog/c_NX2012SA-STD-MUB-1_e.pdf; Temperature Range High: +85°C; Octopart: https://octopart.com/nx2012sa-32.768khz-exs00a-mu00389-ndk-92010294
Y7 = CMP-27762-000273-1: as Y5 on sheet 06-STM32WL3-RX; Series: ASE; Radiation Hardening: No; Lead Free: Lead Free; Package Quantity: 1000; Frequency: 48MHz; Frequency Stability: 50ppm; Case/Package: SMD/SMT; REACH SVHC: No SVHC; Operating Frequency: 48 MHz; Mount: Surface Mount; Min Operating Temperature: -40°C; Packaging: Tape and Reel; Max Operating Temperature: 85°C; Depth: 2.5mm; Height: 0.047inch; Width: 0.098inch; Length: 3.2mm; Termination: SMD/SMT; Number of Pins: 4; Operating Supply Voltage: 3.3V

## Nets that join several sheets
GND: 01-Antennas (25 pins), 02-8A34004_DPLL-1 (20 pins), 05-USB-Prog (50 pins), 06-STM32WL3-RX (29 pins), 07-STM32WL3-TX (28 pins)
P3V3: 02-8A34004_DPLL-1 (13 pins), 05-USB-Prog (R69.1), 06-STM32WL3-RX (21 pins), 07-STM32WL3-TX (22 pins)
RX_VFBSD: 01-Antennas (C13.1 C14.2 L21.2), 06-STM32WL3-RX (6 pins)
TX_VFBSD: 01-Antennas (C2.1 C3.2 L1.2), 07-STM32WL3-TX (6 pins)
DPLL_CLKIN0_P: 02-8A34004_DPLL-1 (R34.1), 06-STM32WL3-RX (U5.9)
DPLL_CLKIN1_P: 02-8A34004_DPLL-1 (R36.1), 06-STM32WL3-RX (R76.2)
DPLL_CLKOUT8_N: 02-8A34004_DPLL-1 (R33.2), 07-STM32WL3-TX (R107.1)
DPLL_CLKOUT8_P: 02-8A34004_DPLL-1 (R39.2), 06-STM32WL3-RX (R86.1)
DPLL_CLKOUT10_P: 02-8A34004_DPLL-1 (R41.2), 06-STM32WL3-RX (U5.7)
DPLL_CS: 02-8A34004_DPLL-1 (R46.1 U11.9), 07-STM32WL3-TX (U7.8)
DPLL_GPIO3: 02-8A34004_DPLL-1 (U11.19), 07-STM32WL3-TX (U7.7)
DPLL_GPIO4: 02-8A34004_DPLL-1 (U11.37), 07-STM32WL3-TX (U7.11)
DPLL_GPIO5: 02-8A34004_DPLL-1 (U11.36), 07-STM32WL3-TX (U7.12)
DPLL_RST_N: 02-8A34004_DPLL-1 (R31.1 U11.17), 07-STM32WL3-TX (U7.19)
DPLL_SCLK: 02-8A34004_DPLL-1 (R49.1 U11.12), 07-STM32WL3-TX (U7.15)
DPLL_SDI: 02-8A34004_DPLL-1 (R45.1 U11.10), 07-STM32WL3-TX (U7.9)
DPLL_SDIO: 02-8A34004_DPLL-1 (R50.1 U11.11), 07-STM32WL3-TX (U7.16)
RX_BOOTSEL: 05-USB-Prog (R59.2), 06-STM32WL3-RX (R75.1 SW1.1 U5.10)
RX_RF_RX: 01-Antennas (C20.1 L25.1), 06-STM32WL3-RX (U5.23)
RX_RF_TX: 01-Antennas (R5.1), 06-STM32WL3-RX (U5.26)
RX_RF_TX_HP: 01-Antennas (R6.1), 06-STM32WL3-RX (U5.25)
RX_RST_N: 05-USB-Prog (R57.2), 06-STM32WL3-RX (R78.2 SW2.1 U5.36), 07-STM32WL3-TX (U7.43)
RX_RX_SEQUENCE: 06-STM32WL3-RX (R76.1), 07-STM32WL3-TX (U7.42)
RX_SPI1_MISO: 06-STM32WL3-RX (U5.35), 07-STM32WL3-TX (U7.34)
RX_SPI1_MOSI: 06-STM32WL3-RX (U5.34), 07-STM32WL3-TX (U7.35)
RX_SPI1_NSS: 06-STM32WL3-RX (U5.33), 07-STM32WL3-TX (U7.33)
RX_SPI1_SCK: 06-STM32WL3-RX (U5.32), 07-STM32WL3-TX (U7.32)
RX_SPI3_MISO: 06-STM32WL3-RX (U5.5), 07-STM32WL3-TX (U7.31)
RX_SPI3_MOSI: 06-STM32WL3-RX (U5.31), 07-STM32WL3-TX (U7.5)
RX_SPI3_NSS: 06-STM32WL3-RX (U5.6), 07-STM32WL3-TX (U7.6)
RX_SPI3_SCK: 06-STM32WL3-RX (U5.13), 07-STM32WL3-TX (U7.13)
RX_TX_SEQUENCE: 06-STM32WL3-RX (U5.19), 07-STM32WL3-TX (U7.44)
RX_USART1_RX: 05-USB-Prog (R11.2), 06-STM32WL3-RX (U5.45)
RX_USART1_TX: 05-USB-Prog (R12.2), 06-STM32WL3-RX (U5.30)
TX_BOOTSEL: 05-USB-Prog (R68.2), 07-STM32WL3-TX (R100.1 SW3.1 U7.10)
TX_LPUART_RX: 06-STM32WL3-RX (U5.4), 07-STM32WL3-TX (U7.14)
TX_LPUART_TX: 06-STM32WL3-RX (U5.14), 07-STM32WL3-TX (U7.4)
TX_RF_RX: 01-Antennas (C9.1 L20.1), 07-STM32WL3-TX (U7.23)
TX_RF_TX: 01-Antennas (R1.1), 07-STM32WL3-TX (U7.26)
TX_RF_TX_HP: 01-Antennas (R2.1), 07-STM32WL3-TX (U7.25)
TX_RST_N: 05-USB-Prog (R67.2), 07-STM32WL3-TX (R101.2 SW4.1 U7.36)
TX_RX_SPARE0: 06-STM32WL3-RX (U5.48), 07-STM32WL3-TX (U7.48)
TX_RX_SPARE2: 06-STM32WL3-RX (U5.20), 07-STM32WL3-TX (U7.20)
TX_USART1_RX: 05-USB-Prog (R62.2), 07-STM32WL3-TX (U7.45)
TX_USART1_TX: 05-USB-Prog (R63.2), 07-STM32WL3-TX (U7.30)

## Assembly variants
845-XXXXX_PCBA_projectname: all parts fitted